# EasyEDA Pro project SBT10X_single_led.eprj

# Schematic Schematic1
Board Name: Board1; Create Date: 2025-06-19; Page Name: P1; Project Name: SBT10X_single_led; Schematic Name: Schematic1; Update Date: 2025-06-19; Company: EasyEDA.com; Page Size: A4; Version: V1.0
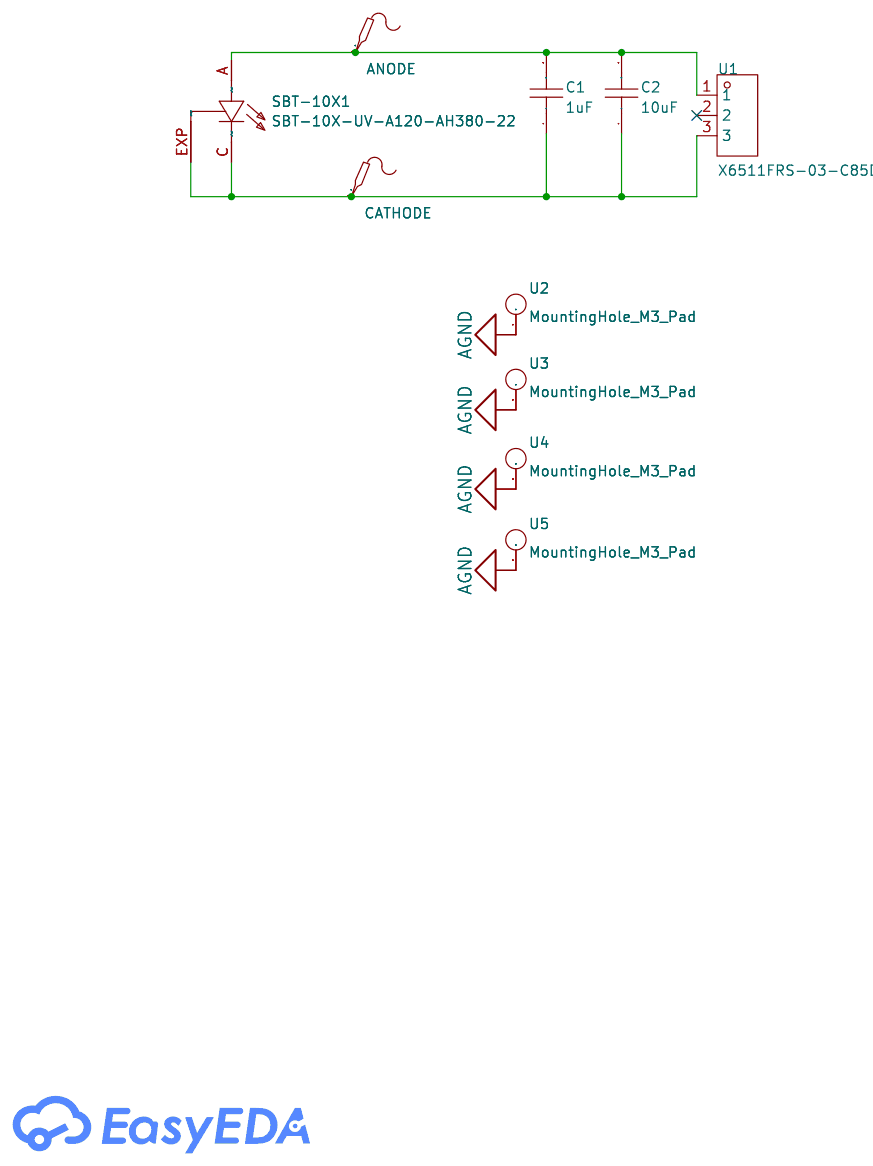
[diagram p0: schematic sheet]

## Parts
ANODE  -  [Test-Point-0.5mm]
C1  1uF  [C0805]
C2  10uF  [C1206]
CATHODE  -  [Test-Point-0.5mm]
SBT-10X1  SBT-10X-UV-A120-AH380-22  [custom_lib:LED_SBT-10X-UV-A120-AH380-22]
U1  X6511FRS-03-C85D30  [HDR-SMD_3P-P2.54-H-F-L11.5]
U2  MountingHole_M3_Pad  [MountingHole_3.2mm_M3_DIN965_Pad_TopOnly]
U3  MountingHole_M3_Pad  [MountingHole_3.2mm_M3_DIN965_Pad_TopOnly]
U4  MountingHole_M3_Pad  [MountingHole_3.2mm_M3_DIN965_Pad_TopOnly]
U5  MountingHole_M3_Pad  [MountingHole_3.2mm_M3_DIN965_Pad_TopOnly]

## Library data of the parts
ANODE CATHODE = Test-Point
C1 = 08055C105KAT2A: LCSC Part Name: 1uF ±10% 50V; Supplier Part: C2167382; Manufacturer: Kyocera AVX; Supplier Footprint: 0805; JLCPCB Part Class: Extended Part; Supplier: LCSC; Tolerance: ±10%; Voltage Rating: 50V; Temperature Coefficient: X7R
C2 = CGA1206X7R106K500NT: LCSC Part Name: 10uF ±10% 50V; Supplier Part: C6119989; Manufacturer: HRE(芯声); Supplier Footprint: 1206; JLCPCB Part Class: Extended Part; Supplier: LCSC; Tolerance: ±10%; Voltage Rating: 50V; Temperature Coefficient: X7R
SBT-10X1 = SBT-10X-UV-A120-AH380-22_SBT-10X-UV-A120-AH380-22: \n                        \n                            Ultraviolet (UV) Emitter 385nm, 1.3 W, 3.1V 1.0 A, 120°, 3.5mm x 3.5mm\n                        \n; availability: In Stock; check_prices: https://www.snapeda.com/parts/SBT-10X-UV-A120-AH380-22/Luminus+Devices/view-part/?ref=eda; manufacturer: Luminus Devices; maximum_package_height: 1.87mm; mf: Luminus Devices; partrev: 01; Package1: None; price: None; standard: Manufacturer Recommendations; snapeda_link: https://www.snapeda.com/parts/SBT-10X-UV-A120-AH380-22/Luminus+Devices/view-part/?ref=snap; MF: Luminus Devices; MAXIMUM_PACKAGE_HEIGHT: 1.87mm; Price: None; Check_prices: https://www.snapeda.com/parts/SBT-10X-UV-A120-AH380-22/Luminus+Devices/view-part/?ref=eda; STANDARD: Manufacturer Recommendations; PARTREV: 01; SnapEDA_Link: https://www.snapeda.com/parts/SBT-10X-UV-A120-AH380-22/Luminus+Devices/view-part/?ref=snap; Availability: In Stock; MANUFACTURER: Luminus Devices
U1 = X6511FRS-03-C85D30: LCSC Part Name: 间距:2.54mm 1x3P 卧贴; Supplier Part: C5142236; Manufacturer: XKB Connectivity(中国星坤); Supplier Footprint: SMD,P=2.54mm,卧贴; JLCPCB Part Class: Extended Part; Datasheet: https://atta.szlcsc.com/upload/public/pdf/source/20220822/AB9A82E80C220285963E5EFA3BFD32FF.pdf; Supplier: LCSC; Holes Structure: 1x3P; Pitch: 2.54mm; Mounting Type: 卧贴; Number of Rows: Plugin; Number of Holes: 3P; Insulation Height: 8.5mm
U2-U5 = Mounting_M3_Hole_Pad

## Nets
AGND: U2.1 U3.1 U4.1 U5.1
$1N121: ANODE.1 C1.2 C2.2 SBT-10X1.A U1.1
$1N202: C1.1 C2.1 CATHODE.1 SBT-10X1.C SBT-10X1.EXP U1.3

Not connected (* = marked no-connect by the designer): U1 2*

# Board PCB1
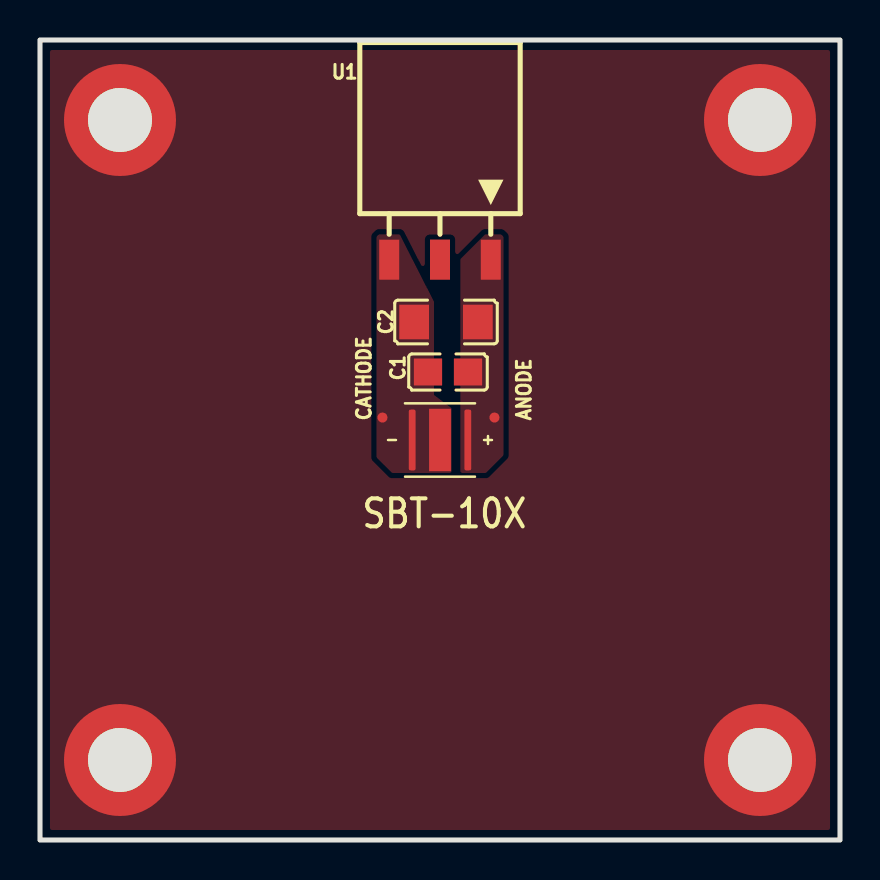
[diagram p1: board, top side]
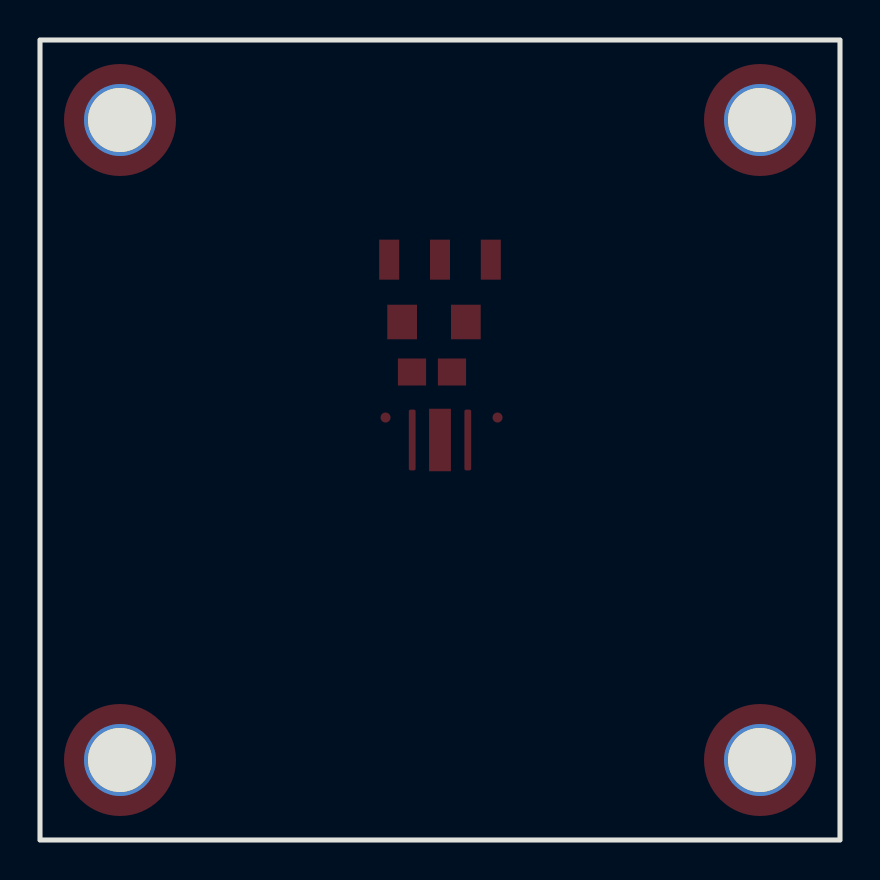
[diagram p2: board, bottom side, seen from below]

Outline 40 x 40 mm; copper layers: Top Layer, Bottom Layer. Coordinates in mm from the lower left corner of the outline.
Outline path: rectangle 0,40 40,0
Stack: Top Layer 0.035mm / Dielectric1 1.51mm FR4 er 4.5 / Bottom Layer 0.035mm

## Design rules (mm)
template: Custom Config
spacing copperThickness1oz (default): track to track 0.102, other pairs 0.152 to 0.3
spacing copperThickness2oz: track to track 0.203, other pairs 0.152 to 0.3
track width copperThickness1oz (default): min 0.127, default 0.254, max 2.54
track width copperThickness2oz: min 0.203, default 0.254, max 2.54
differential pair differentialPair (default): width min 0.127, default 0.254, max 2.54; gap min 0.152, default 0.152
via viaSize (default): diameter min 0.5, default 0.61, max 10; hole min 0.3, default 0.305, max 6.3
pour e3 uses copperRegion

## Placement (name value [footprint] x y rotation side)
ANODE  -  [Test-Point-0.5mm]  22.72 21.12 90 top
C1  1uF  [C0805]  20.4 23.4 0 top
C2  10uF  [C1206]  20.3 25.9 0 top
CATHODE  -  [Test-Point-0.5mm]  17.12 21.12 90 top
SBT-10X1  SBT-10X-UV-A120-AH380-22  [custom_lib:LED_SBT-10X-UV-A120-AH380-22]  20 20 0 top
U1  X6511FRS-03-C85D30  [HDR-SMD_3P-P2.54-H-F-L11.5]  20 29.02 180 top
U2  MountingHole_M3_Pad  [MountingHole_3.2mm_M3_DIN965_Pad_TopOnly]  4 36 0 top
U3  MountingHole_M3_Pad  [MountingHole_3.2mm_M3_DIN965_Pad_TopOnly]  36 36 0 top
U4  MountingHole_M3_Pad  [MountingHole_3.2mm_M3_DIN965_Pad_TopOnly]  36 4 0 top
U5  MountingHole_M3_Pad  [MountingHole_3.2mm_M3_DIN965_Pad_TopOnly]  4 4 0 top

## Footprints (pads in the part's own frame, mm; a bottom-side part is the same pattern mirrored in y, then rotated)
C0805
  rect 1.41x1.35 smd: 1(-1,0) 2(1,0)
C1206
  rect 1.485x1.728 smd: 1(-1.593,0) 2(1.593,0)
custom_lib:LED_SBT-10X-UV-A120-AH380-22
  rrect 0.34x3.04 smd: A(1.39,0) C(-1.39,0)
  rect 1.092x3.124 smd: EXP(0,0)
HDR-SMD_3P-P2.54-H-F-L11.5
  rect 1x2 smd: 1(-2.54,0) 2(0,0) 3(2.54,0)
MountingHole_3.2mm_M3_DIN965_Pad_TopOnly
  round 3.6 hole 3.2: 1(0,0)
  round 5.6 smd: 1(0,0)
Test-Point-0.5mm
  round 0.5 smd: 1(0,0)

## Nets
As in the schematic.

Pads without a net: U1 2

## Copper pours and planes (outline as drawn; the poured copper is in the pictures)
AGND on Top Layer: 0.5,39.5 39.5,39.5 39.5,0.5 0.5,0.5
$1N121 on Top Layer: 21.02,18.35 21.02,29.05 22.26,30.29 23.05,30.29 23.18,30.16 23.18,19.24 22.29,18.35
$1N202 on Top Layer: 20.58,18.35 20.58,21.59 19.7,22.25 19.7,26.92 17.98,30.29 16.95,30.29 16.82,30.16 16.82,19.13 17.61,18.35

## Text on the board
Top Silkscreen Layer: SBT-10X
